# Altium schematic sheet Sheet1.SchDoc
size A3; SheetNumber: 1; SheetTotal: 1
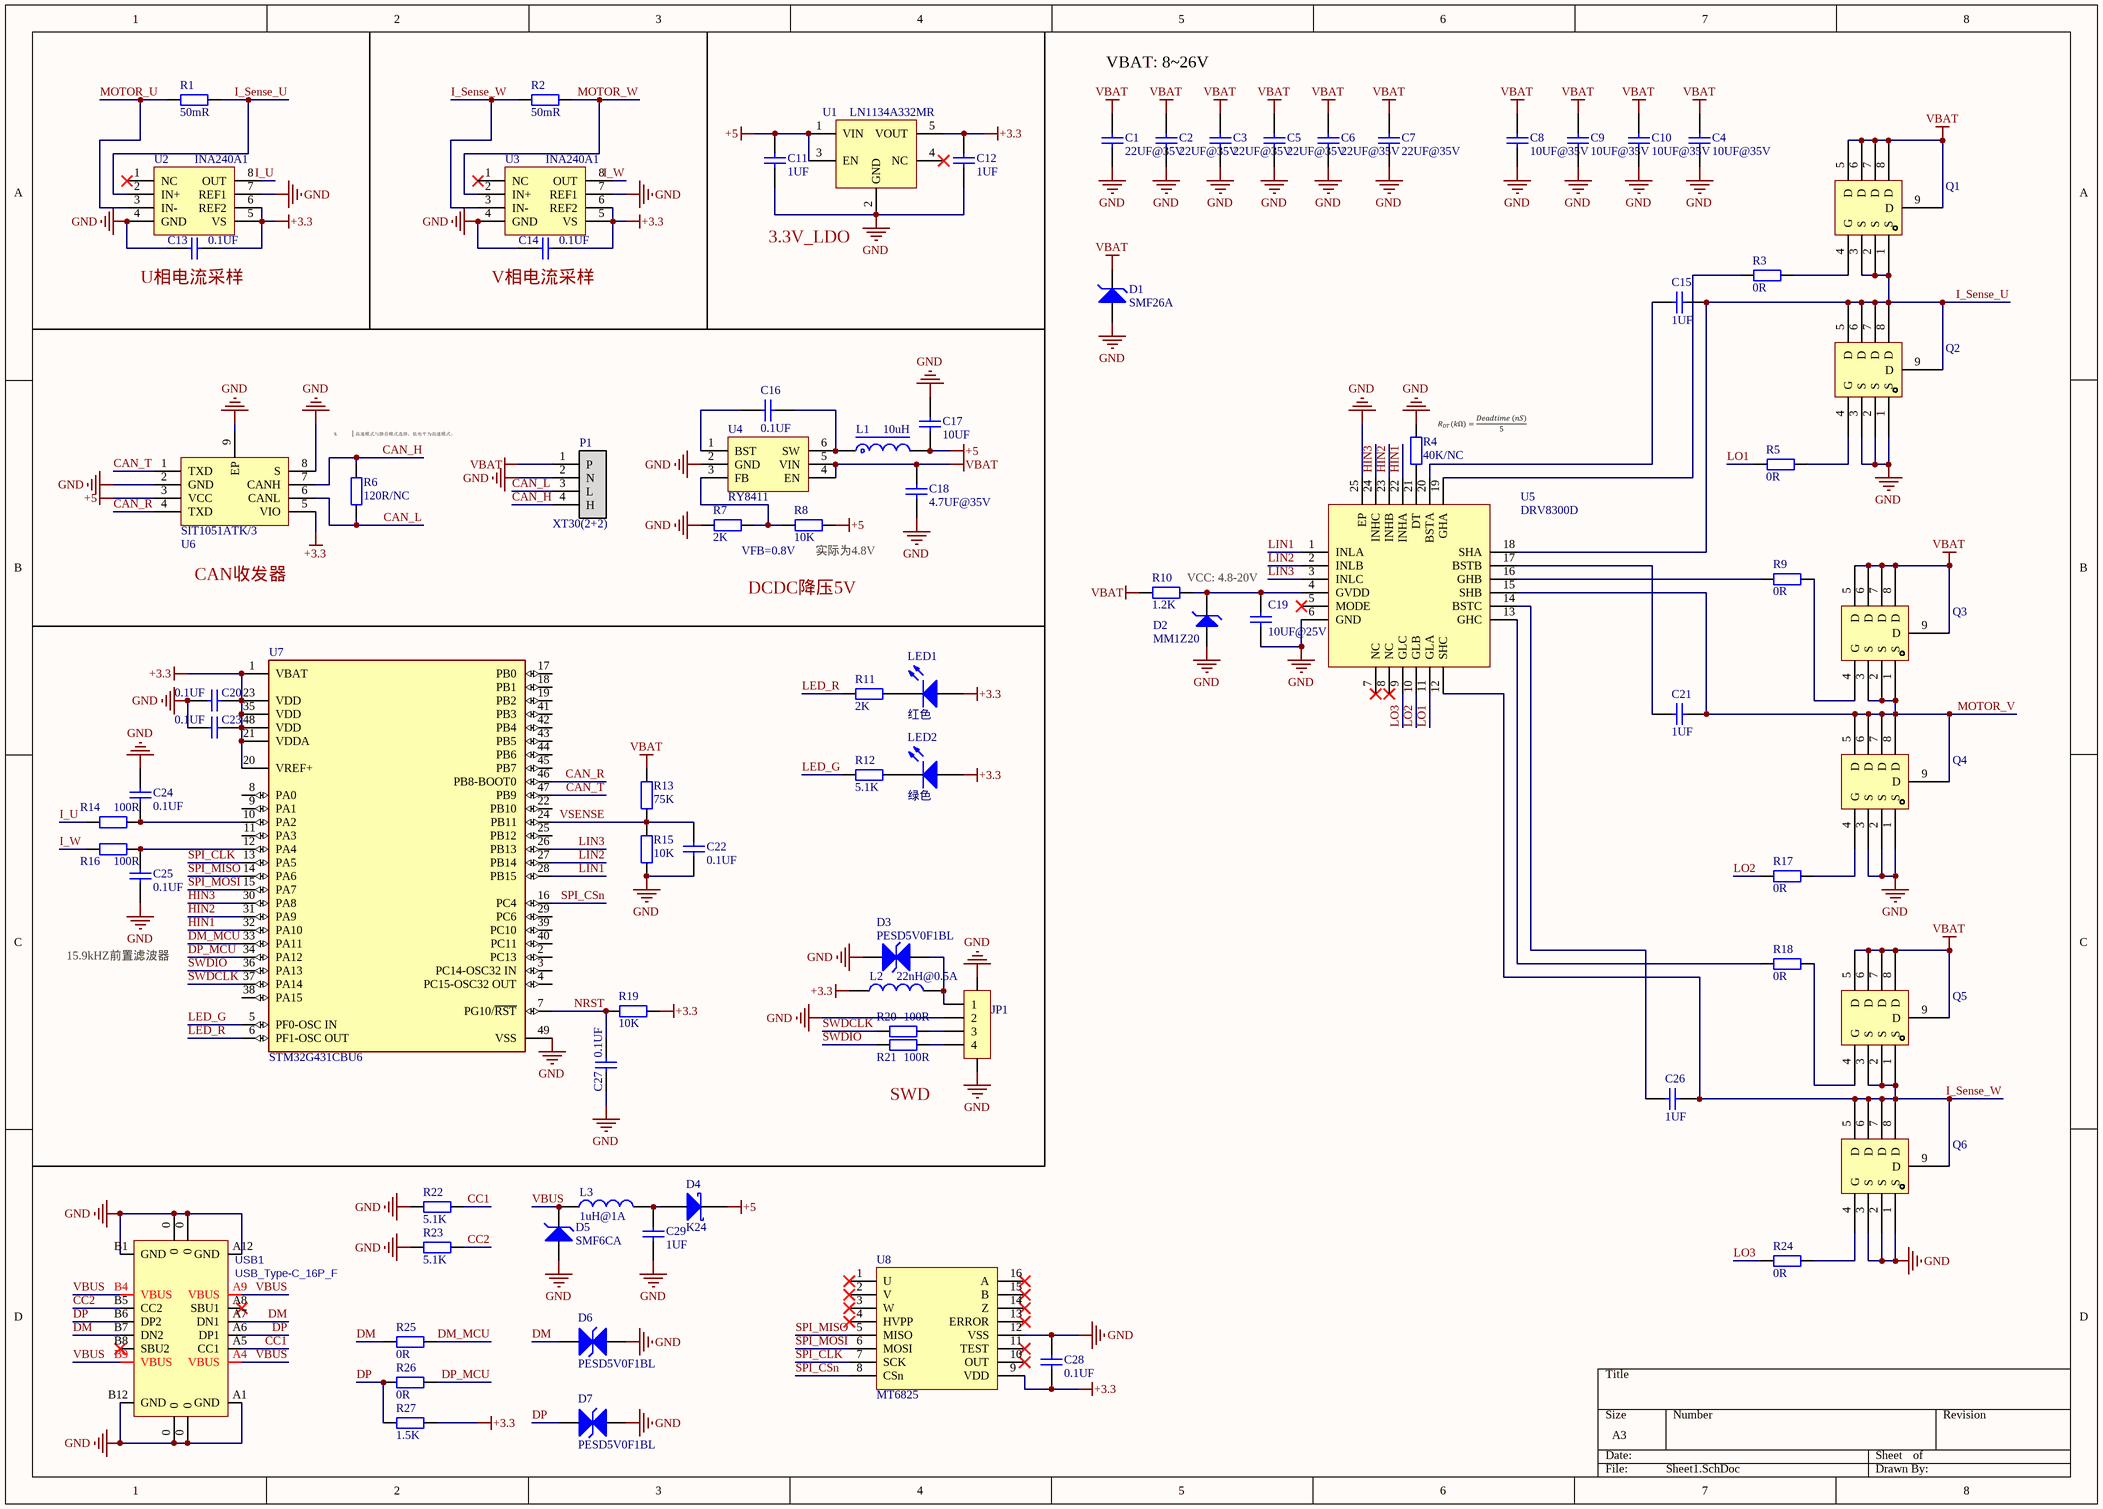
[diagram p0: Sheet1.SchDoc]

## Parts
C1  22UF@35V  [C1206_NS]
C2  22UF@35V  [C1206_NS]
C3  22UF@35V  [C1206_NS]
C4  10UF@35V  [C0805_NS]
C5  22UF@35V  [C1206_NS]
C6  22UF@35V  [C1206_NS]
C7  22UF@35V  [C1206_NS]
C8  10UF@35V  [C0805_NS]
C9  10UF@35V  [C0805_NS]
C10  10UF@35V  [C0805_NS]
C11  1UF  [C0402_NS]
C12  1UF  [C0402_NS]
C13  0.1UF  [C0402_NS]
C14  0.1UF  [C0402_NS]
C15  1UF  [C0603_NS]
C16  0.1UF  [C0402_NS]
C17  10UF  [C0805_NS]
C18  4.7UF@35V  [C0805_NS]
C19  10UF@25V  [C0603_NS]
C20  0.1UF  [C0402_NS]
C21  1UF  [C0603_NS]
C22  0.1UF  [C0402_NS]
C23  0.1UF  [C0402_NS]
C24  0.1UF  [C0402_NS]
C25  0.1UF  [C0402_NS]
C26  1UF  [C0603_NS]
C27  0.1UF  [C0402_NS]
C28  0.1UF  [C0402_NS]
C29  1UF  [C0603_NS]
D1  SMF26A  [SOD-123]
D2  MM1Z20  [SOD-123]
D3  PESD5V0F1BL  [DFN1002-2L_L1.0_W0.6_P0.7]
D4  K24  [SOD-123]
D5  SMF6CA  [SOD-123]
D6  PESD5V0F1BL  [DFN1002-2L_L1.0_W0.6_P0.7]
D7  PESD5V0F1BL  [DFN1002-2L_L1.0_W0.6_P0.7]
JP1  CON-4P  [HC0.8-WT-4P]  (value not drawn)
L1  10uH  [NR3015]
L2  22nH@0.5A  [L0402_NS]
L3  1uH@1A  [L1206_NS]
LED1  红色  [LED0402_NS]
LED2  绿色  [LED0402_NS]
P1  XT30(2+2)  [XT30(2+2)PW-M]
Q1  WSD3066DN33  [DFN8_L3.3_W3.3_P0.65]  (value not drawn)
Q2  WSD3066DN33  [DFN8_L3.3_W3.3_P0.65]  (value not drawn)
Q3  WSD3066DN33  [DFN8_L3.3_W3.3_P0.65]  (value not drawn)
Q4  WSD3066DN33  [DFN8_L3.3_W3.3_P0.65]  (value not drawn)
Q5  WSD3066DN33  [DFN8_L3.3_W3.3_P0.65]  (value not drawn)
Q6  WSD3066DN33  [DFN8_L3.3_W3.3_P0.65]  (value not drawn)
R1  50mR  [R1206_NS]
R2  50mR  [R1206_NS]
R3  0R  [R0402_NS]
R4  40K/NC  [R0402_NS]
R5  0R  [R0402_NS]
R6  120R/NC  [R0603_NS]
R7  2K  [R0402_NS]
R8  10K  [R0402_NS]
R9  0R  [R0402_NS]
R10  1.2K  [R0603_NS]
R11  2K  [R0402_NS]
R12  5.1K  [R0402_NS]
R13  75K  [R0402_NS]
R14  100R  [R0402_NS]
R15  10K  [R0402_NS]
R16  100R  [R0402_NS]
R17  0R  [R0402_NS]
R18  0R  [R0402_NS]
R19  10K  [R0402_NS]
R20  100R  [R0402_NS]
R21  100R  [R0402_NS]
R22  5.1K  [R0402_NS]
R23  5.1K  [R0402_NS]
R24  0R  [R0402_NS]
R25  0R  [R0402_NS]
R26  0R  [R0402_NS]
R27  1.5K  [R0402_NS]
U1  LN1134A332MR  [SOT23-5_L3.0_W1.7_P0.95]
U2  INA240A1  [TSSOP8_L4.4_W3.0_P0.65]
U3  INA240A1  [TSSOP8_L4.4_W3.0_P0.65]
U4  RY8411  [SOT23-6_L3.0_W1.7_P0.95]
U5  DRV8300D  [QFN24_L4.0_W4.0_P0.5]
U6  SIT1051ATK/3  [DFN8_L3.0_W3.0_P0.65]
U7  STM32G431CBU6  [QFN48_L7.0_W7.0_P0.5]
U8  MT6825  [TSSOP16_L5.0_W4.4_P0.65]
USB1  USB_Type-C_16P_F  [USB_Type-C_SMD_16P_F]

## Nets
+3.3: C12.2 C13.2 C14.2 C20.1 C23.1 C28.2 L2.1 LED1.1(A) LED2.1(A) R19.2 R27.2 U1.5(VOUT) U2.5(VS) U2.6(REF2) U3.5(VS) U3.6(REF2) U6.5(VIO) U7.1(VBAT) U7.20(VREF+) U7.21(VDDA) U7.23(VDD) U7.35(VDD) U7.48(VDD) U8.9(VDD)
+5: C11.2 C17.2 D4.2(K) L1.2 R8.1 U1.1(VIN) U1.3(EN) U6.3(VCC)
GND: C1.2 C2.2 C3.2 C4.2 C5.2 C6.2 C7.2 C8.2 C9.2 C10.2 C11.1 C12.1 C13.1 C14.1 C17.1 C18.1 C19.1 C20.2 C22.2 C23.2 C24.1 C25.2 C27.1 C28.1 C29.1 D1.1(A) D2.1(A) D3.2(K) D5.1(A) D6.2(K) D7.2(K) JP1.0 JP1.2 P1.2(N) Q2.1(S) Q2.2(S) Q2.3(S) Q4.1(S) Q4.2(S) Q4.3(S) Q6.1(S) Q6.2(S) Q6.3(S) R4.2 R7.2 R15.1 R22.1 R23.1 U1.2(GND) U2.4(GND) U2.7(REF1) U3.4(GND) U3.7(REF1) U4.2(GND) U5.6(GND) U5.25(EP) U6.2(GND) U6.8(S) U6.9(EP) U7.49(VSS) U8.12(VSS) USB1.0 USB1.A1(GND) USB1.A12(GND) USB1.B1(GND) USB1.B12(GND)
VBAT: C1.1 C2.1 C3.1 C4.1 C5.1 C6.1 C7.1 C8.1 C9.1 C10.1 C18.2 D1.2(K) P1.1(P) Q1.5(D) Q1.6(D) Q1.7(D) Q1.8(D) Q1.9(D) Q3.5(D) Q3.6(D) Q3.7(D) Q3.8(D) Q3.9(D) Q5.5(D) Q5.6(D) Q5.7(D) Q5.8(D) Q5.9(D) R10.1 R13.2 U4.4(EN) U4.5(VIN)
CAN_H: P1.4(H) R6.2 U6.7(CANH)
CAN_L: P1.3(L) R6.1 U6.6(CANL)
CAN_R: U6.4(TXD) U7.46(PB8-BOOT0)
CAN_T: U6.1(TXD) U7.47(PB9)
CC1: R22.2 USB1.A5(CC1)
CC2: R23.2 USB1.B5(CC2)
DM: D6.1(A) R25.1 USB1.A7(DN1) USB1.B7(DN2)
DM_MCU: R25.2 U7.33(PA11)
DP: D7.1(A) R26.1 R27.1 USB1.A6(DP1) USB1.B6(DP2)
DP_MCU: R26.2 U7.34(PA12)
HIN1: U5.22(INHA) U7.32(PA10)
HIN2: U5.23(INHB) U7.31(PA9)
HIN3: U5.24(INHC) U7.30(PA8)
I_Sense_U: C15.1 Q1.1(S) Q1.2(S) Q1.3(S) Q2.5(D) Q2.6(D) Q2.7(D) Q2.8(D) Q2.9(D) R1.1 U2.2(IN+) U5.18(SHA)
I_Sense_W: C26.1 Q5.1(S) Q5.2(S) Q5.3(S) Q6.5(D) Q6.6(D) Q6.7(D) Q6.8(D) Q6.9(D) R2.2 U3.3(IN-) U5.12(SHC)
I_U: R14.2 U2.8(OUT)
I_W: R16.2 U3.8(OUT)
LED_G: R12.1 U7.5(PF0-OSC_IN)
LED_R: R11.1 U7.6(PF1-OSC_OUT)
LIN1: U5.1(INLA) U7.28(PB15)
LIN2: U5.2(INLB) U7.27(PB14)
LIN3: U5.3(INLC) U7.26(PB13)
LO1: R5.1 U5.11(GLA)
LO2: R17.1 U5.10(GLB)
LO3: R24.1 U5.9(GLC)
MOTOR_U: R1.2 U2.3(IN-)
MOTOR_V: C21.1 Q3.1(S) Q3.2(S) Q3.3(S) Q4.5(D) Q4.6(D) Q4.7(D) Q4.8(D) Q4.9(D) U5.15(SHB)
MOTOR_W: R2.1 U3.2(IN+)
NRST: C27.2 R19.1 U7.7(PG10/~{RST})
SPI_CLK: U7.13(PA5) U8.7(SCK)
SPI_CSn: U7.16(PC4) U8.8(CSn)
SPI_MISO: U7.14(PA6) U8.5(MISO)
SPI_MOSI: U7.15(PA7) U8.6(MOSI)
SWDCLK: R20.1 U7.37(PA14)
SWDIO: R21.1 U7.36(PA13)
VBUS: D5.2(K) L3.1 USB1.A4(VBUS) USB1.A9(VBUS) USB1.B4(VBUS) USB1.B9(VBUS)
VSENSE: C22.1 R13.1 R15.2 U7.24(PB11)
NetC15_2: C15.2 U5.20(BSTA)
NetC16_1: C16.1 U4.1(BST)
NetC16_2: C16.2 L1.1 U4.6(SW)
NetC19_2: C19.2 D2.2(K) R10.2 U5.4(GVDD)
NetC21_2: C21.2 U5.17(BSTB)
NetC24_2: C24.2 R14.1 U7.10(PA2)
NetC25_1: C25.1 R16.1 U7.12(PA4)
NetC26_2: C26.2 U5.14(BSTC)
NetC29_2: C29.2 D4.1(A) L3.2
NetD3_1: D3.1(A) JP1.1 L2.2
NetJP1_3: JP1.3 R20.2
NetJP1_4: JP1.4 R21.2
NetLED1_2: LED1.2(K) R11.2
NetLED2_2: LED2.2(K) R12.2
NetQ1_4: Q1.4(G) R3.2
NetQ2_4: Q2.4(G) R5.2
NetQ3_4: Q3.4(G) R9.2
NetQ4_4: Q4.4(G) R17.2
NetQ5_4: Q5.4(G) R18.2
NetQ6_4: Q6.4(G) R24.2
NetR3_1: R3.1 U5.19(GHA)
NetR4_1: R4.1 U5.21(DT)
NetR7_1: R7.1 R8.2 U4.3(FB)
NetR9_1: R9.1 U5.16(GHB)
NetR18_1: R18.1 U5.13(GHC)

Not connected (* = marked no-connect by the designer): U1 4(NC)*; U2 1(NC)*; U3 1(NC)*; U5 5(MODE)* 7(NC)* 8(NC)*; U7 2(PC13) 3(PC14-OSC32_IN) 4(PC15-OSC32_OUT) 8(PA0) 9(PA1) 11(PA3) 17(PB0) 18(PB1) 19(PB2) 22(PB10) 25(PB12) 29(PC6) 38(PA15) 39(PC10) 40(PC11) 41(PB3) 42(PB4) 43(PB5) 44(PB6) 45(PB7); U8 1(U)* 2(V)* 3(W)* 4(HVPP)* 10(OUT)* 11(TEST)* 13(ERROR)* 14(Z)* 15(B)* 16(A)*; USB1 A8(SBU1)* B8(SBU2)*

## Notes on the sheet
- VBAT: 8~26V
- 3.3V_LDO
- (near C13) U相电流采样
- (near C14) V相电流采样
- CAN收发器
- VFB=0.8V
- (near R8) 实际为4.8V
- (near R10) VCC: 4.8-20V
- DCDC降压5V
- 15.9kHZ前置滤波器
- SWD

## Library data of the parts
C1-C29 = C: 贴片电容/MLCC电容; BOM名称: MLCC
D1 D5 = TVS: TVS通用; BOM名称: TVS
D2 = MM1ZXX: 稳压二极管; Power Dissipation (Pd): 500mW; Voltage: 5.1V; BOM名称: 稳压二极管
D3 D6 D7 = PESD5V0F1BL: 双向静电和浪涌保护(TVS/ESD); BOM名称: PESD5V0F1BL
D4 = SSXX: 肖特基二极管; 属性: 个位*10V/十位A; BOM名称: 肖特基二极管
JP1 = Header 4: 4P连接器; BOM名称: 4P连接器
L1 = L-NR: 太诱-NR磁胶电感; BOM名称: NR磁胶电感
L2 L3 = L: 小功率贴片电感; BOM名称: 小功率贴片电感
LED1 LED2 = LED: 贴片LED; BOM名称: 贴片LED
P1 = XT30(2+2): XT30(2+2)连接器
Q1-Q6 = WSD3066DN33: 类型:N沟道;漏源电压(Vdss):30V;连续漏极电流(Id):50A;导通电阻(RDS(on)Vgs,Id):5.7mΩ@10V,35A;阈值电压(Vgs(th)@Id):2.5V@250uA;; Type: N沟道; Drain Source Voltage (Vdss): 30V; Continuous Drain Current (Id): 50A; Power Dissipation (Pd): 45W; Device: WSD3066DN33; LCSC Part Name: N沟道 30V 50A; Supplier Footprint: DFN 3.3x3.3-8; Drain Source On Resistance (RDS(on)@Vgs,Id): 5.7mΩ@10V,35A; Gate Threshold Voltage (Vgs(th)@Id): 2.5V@250uA
R1-R27 = R: 贴片电阻; BOM名称: 贴片电阻
U1 = RT9013-33GB
U2 U3 = INA240: 具有增强的 PWM 抑制能力的 -4V 至 80V、双向、超精密电流感应放大器
U4 = JW5026: 40V/1A/1.1MHz同步降压转换器
U5 = DRV8300D: 具有自举二极管的最大 100V 简单三相栅极驱动器
U6 = SIT1051ATK/3: 5V 供电， IO 口兼容 3.3V，± 70V 总线耐压， CAN FD 静音模式总线收发器; Duplex: Half; Data Rate: 5Mbps; Type: Transceiver; Protocol: CAN
U7 = STM32G431CBU6: Microcontroller 32-Bit ARM Cortex-M4 RISC 128KB Flash 1.71V to 3.6V QFN48; Manufacturer: STMicroelectronics; Manufacturer Part Number: STM32G431CBT6; Number Of Adc Channels: 17; Number Of I/Os: 38; Standoff Height: 0.05mm; Number Of Usb Channels: 1; Data Bus Width: 32bits; Number Of I2C Channels: 3; Number Of Pwm Channels: 31; Frequency: 170MHz; Number Of Timers/Counters: 14; Ram Size: 32KBytes; Max Junction Temp: +105°C; Memory Size: 128KBytes; Min Supply Voltage: 1.62V; Number Of Uart Channels: 4; Interface: I2C,SPI,UART,USART,CAN,USB,LIN,IrDA,I2S; Temperature Range Low: -40°C; Lead Free: Yes; Device Class L3: Microcontrollers; Number Of Cores: 1; Temperature Range High: +85°C; Height: 1.6mm; Digikey Description: MAINSTREAM ARM CORTEX-M4+ MCU 17; Device Class L1: Integrated Circuits (ICs); Package: LQFP48; RoHS: TRUE; Number Of A/D Converters: 1; Core Architecture: Arm Cortex-M4; Memory Type: FLASH; Device Class L2: Embedded Processors and Controllers; ComponentLink2Description: Datasheet; Temperature: -40°C to +85°C; Ambient Temperature Range High: +85°C; Ambient Temperature Range Low: -40°C; Octopart: https://octopart.com/stm32g431cbt6-stmicroelectronics-98835224; Max Supply Voltage: 3.6V; ComponentLink2URL: https://www.st.com/resource/en/datasheet/stm32g431cb.pdf; Automotive: No; Number Of Spi Channels: 3; Category: IC
U8 = MT6825: 18位高分辨率、高速磁性角度编码器IC
USB1 = USB_Type-C_16P_F: USB_Type-C母座; BOM名称: USB_Type-C母座